# EAGLE design PixelShirtConsole (EAGLE 7.2.1)
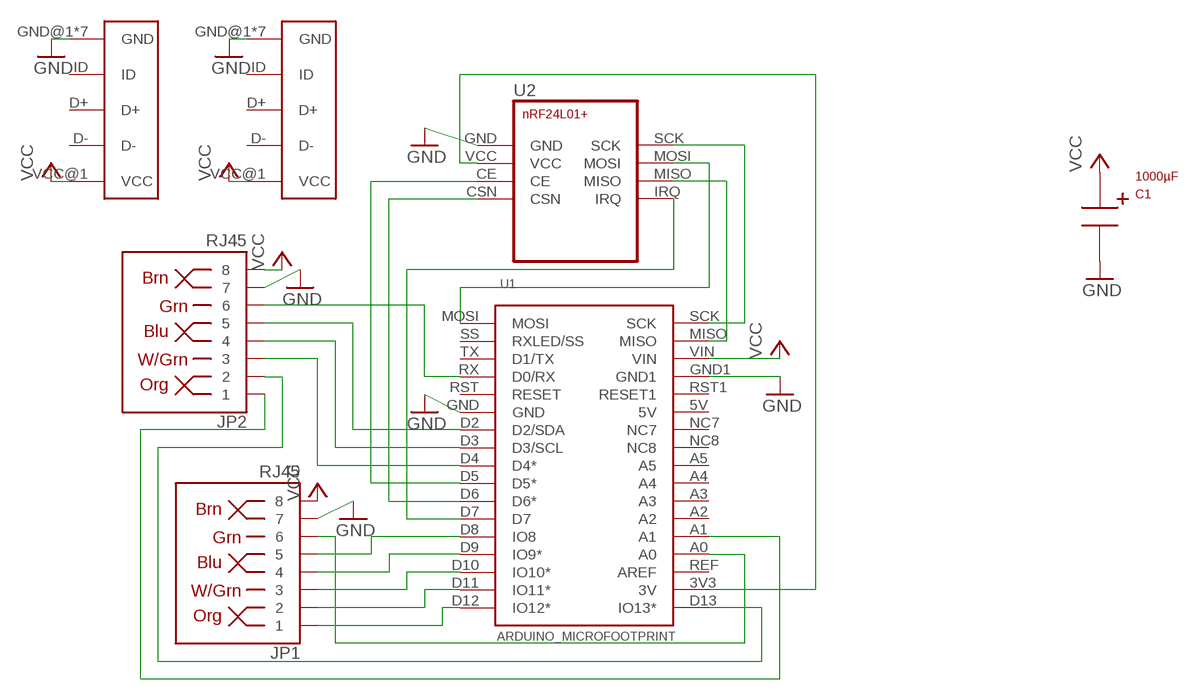
[diagram p0: schematic, sheet 1]

## Parts
C1  1000µF  CAP-CUSTOM  [CAP-CUSTOM]
JP1  RJ45  RJ45-8PTH  [RJ45-8]
JP2  RJ45  RJ45-8PTH  [RJ45-8]
JP3  USB-MICRO-B  [USB-MICRO-B]
JP4  USB-MICRO-B  [USB-MICRO-B]
U1  ARDUINO_MICROFOOTPRINT  [ARDUINO-MICRO]
U2  NRF24L01+  [NRF24L01+]

## Nets
GND: C1.GND JP1.7 JP2.7 JP3.GND@1(GND) JP3.GND@2(GND) JP3.GND@3(GND) JP3.GND@5(GND) JP3.GND@6(GND) JP3.GND@7(GND) JP3.GNF@4(GND) JP4.GND@1(GND) JP4.GND@2(GND) JP4.GND@3(GND) JP4.GND@5(GND) JP4.GND@6(GND) JP4.GND@7(GND) JP4.GNF@4(GND) U1.GND U1.GND1 U2.GND
N$1: U1.MISO U2.MISO
N$2: U1.SCK U2.SCK
N$3: U1.D6(D6*) U2.CSN
N$4: U1.D5(D5*) U2.CE
N$5: U1.MOSI U2.MOSI
N$6: U1.D7 U2.IRQ
N$7: JP1.2 U1.D11(IO11*)
N$8: JP1.3 U1.D10(IO10*)
N$9: JP1.4 U1.D9(IO9*)
N$10: JP1.1 U1.D12(IO12*)
N$11: JP1.6 U1.A0
N$12: JP1.5 U1.D8(IO8)
N$13: JP2.5 U1.D2(D2/SDA)
N$14: JP2.4 U1.D3(D3/SCL)
N$15: JP2.3 U1.D4(D4*)
N$16: JP2.6 U1.RX(D0/RX)
N$17: JP2.1 U1.A1
N$18: JP2.2 U1.D13(IO13*)
N$19: U1.3V3(3V) U2.VCC
VCC: C1.VCC JP1.8 JP2.8 JP3.VCC@1(VCC) JP4.VCC@1(VCC) U1.VIN
Unconnected: JP3.D+ JP3.D- JP3.ID JP4.D+ JP4.D- JP4.ID U1.5V U1.A2 U1.A3 U1.A4 U1.A5 U1.NC7 U1.NC8 U1.REF(AREF) U1.RST1(RESET1) U1.RST(RESET) U1.SS(RXLED/SS) U1.TX(D1/TX)

## Library data of the parts
C1 = usb:CAP-CUSTOM
JP1 JP2 = SparkFun-Connectors:RJ45-8: RJ45 Jack Simple RJ45, 8-pin connection - connector for common Cat5, Cat5e, and Cat6 Ethernet cables. Footprint not yet proven in production. Connector sku is PRT-00643; Breakout PCB sku is BOB-00716.; PROD_ID: CONN-08506
JP3 JP4 = usb:USB-MICRO-B
U1 = arduino-micro:ARDUINO_MICRO
U2 = nrf24L01%2B:NRF24L01+: nRF24L01+ Transceiver Module

## Board
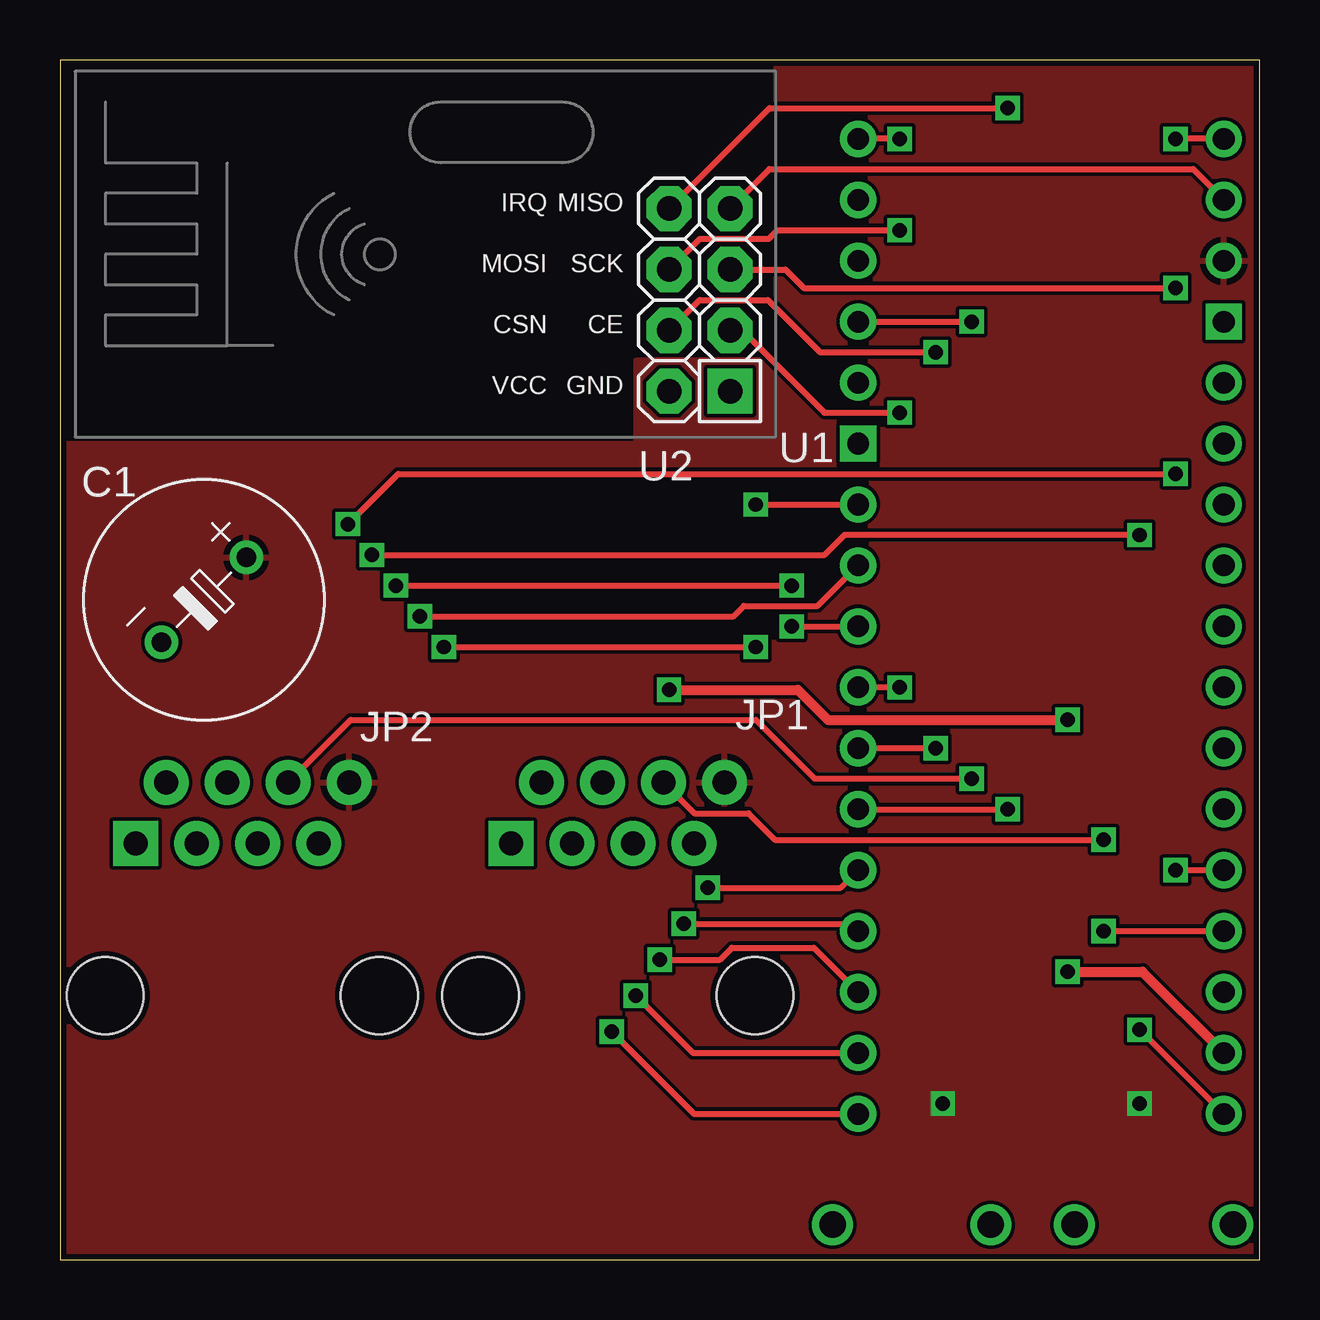
[diagram p1: board, top side]
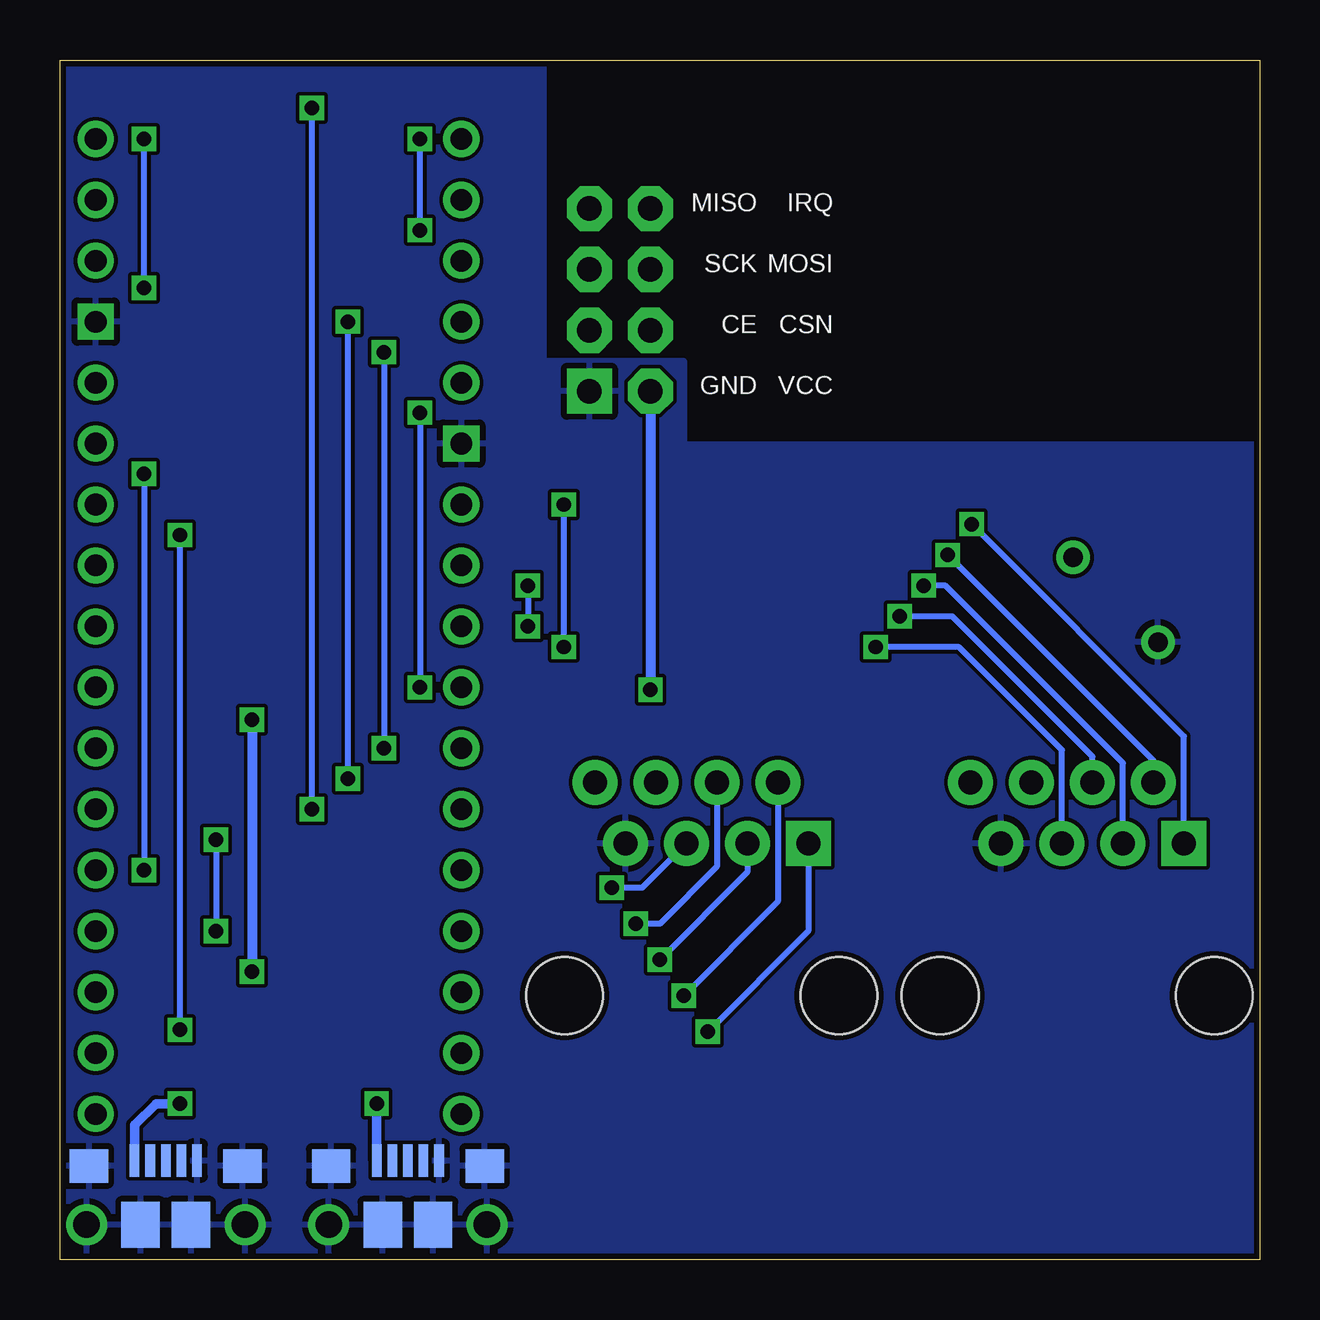
[diagram p2: board, bottom side, seen from below]

Size 50 x 50 mm. Coordinates in mm from the lower left corner, seen from the top.
Outline: 0,0 50,0 50,50 0,50 0,0
Copper layers (1*16): Top 0.035mm / dielectric 1.5mm / Bottom 0.035mm
Design rules "DFRobot_Eagle_Rule_v0.4": minimum track width 6mil, minimum drill 12mil, track to track 6mil, track to pad 6mil, pad to pad 6mil, via to via 6mil, smd to smd 0mil, copper to edge 10mil, drill to drill 10mil, minimum pad ring 12mil, minimum via ring 8mil, stop-mask expansion 2mil, vias tented up to drill 25mil, thermal gap 10mil

### Footprints (pad centres in the part's own frame; a part is rotated, then mirrored left to right if it is on the bottom)
CAP-CUSTOM = drill 0.8: GND -2.5,0; VCC 2.5,0
RJ45-8 = drill 1 pad 1.88 square: 1 -4.445,6.35 | drill 1 pad 1.88: 2 -3.175,8.89; 3 -1.905,6.35; 4 -0.635,8.89; 5 0.635,6.35; 6 1.905,8.89; 7 3.175,6.35; 8 4.445,8.89 | hole 3.2: -5.715,0; 5.715,0
USB-MICRO-B = smd 0.4 x 1.35: D+ 0,2.675; D- -0.65,2.675; GND@1 1.3,2.675; ID 0.65,2.675; VCC@1 -1.3,2.675 | smd 1.6 x 1.4: GND@2 -3.2,2.45; GND@3 3.2,2.45 | smd 1.6 x 1.9: GND@5 1.05,0; GNF@4 -1.05,0 | drill 1.1 pad 1.5: GND@6 -3.3,0; GND@7 3.3,0
ARDUINO-MICRO = drill 0.9: 3V3 16.51,3.81; 5V 16.51,29.21; A0 16.51,8.89; A1 16.51,11.43; A2 16.51,13.97; A3 16.51,16.51; A4 16.51,19.05; A5 16.51,21.59; D2 1.27,26.67; D3 1.27,24.13; D4 1.27,21.59; D5 1.27,19.05; D6 1.27,16.51; D7 1.27,13.97; D8 1.27,11.43; D9 1.27,8.89; D10 1.27,6.35; D11 1.27,3.81; D12 1.27,1.27; D13 16.51,1.27; MISO 16.51,39.37; MOSI 1.27,41.91; NC7 16.51,26.67; NC8 16.51,24.13; REF 16.51,6.35; RST 1.27,31.75; RST1 16.51,31.75; RX 1.27,34.29; SCK 16.51,41.91; SS 1.27,39.37; TX 1.27,36.83; VIN 16.51,36.83 | drill 0.9 square: GND 1.27,29.21; GND1 16.51,34.29
NRF24L01+ = drill 1.016 pad 1.88 octagon: CE -11.43,1.27; CSN -8.89,1.27; IRQ -8.89,-3.81; MISO -11.43,-3.81; MOSI -8.89,-1.27; SCK -11.43,-1.27; VCC -8.89,3.81 | drill 1.016 pad 1.88 square: GND -11.43,3.81

### Placement (x,y rotation side)
C1  6,27.5 45 top
JP1  23.25,11 0 top
JP2  7.6,11 0 top
JP3  45.59,1.45 0 bottom
JP4  35.5,1.45 0 bottom
U1  32,4.8 0 top
U2  16.5,40 180 top

### Tracks (layer width: path | path; a pad name or v marks a point on that pad's centre or on a via)
GND
  pour Bottom: 0,0 50,0 50,50 29.84,50 29.84,37.46 24,37.46 24,34 0,34
N$1
  Top 0.254: U1.MISO 47.23,45.45 29.57,45.45 U2.MISO
N$2  (via drill 0.6)
  Top 0.254: v46.5,40.5 31,40.5 30.23,41.27 U2.SCK | U1.SCK v46.5,46.71
  Bottom 0.254: v46.5,40.5 v46.5,46.71
N$3  (via drill 0.6)
  Top 0.254: v36.5,21.31 U1.D6 | U2.CSN 26.66,40 29.5,40 31.68,37.82 v36.5,37.82
  Bottom 0.254: v36.5,37.82 v36.5,21.31
N$4  (via drill 0.6)
  Top 0.254: v35,23.85 U1.D5 | v35,35.3 31.86,35.3 28.43,38.73 U2.CE
  Bottom 0.254: v35,35.3 v35,23.85
N$5  (via drill 0.6)
  Top 0.254: U2.MOSI 26.67,42.55 29.55,42.55 29.9,42.9 v35,42.9 | v35,46.71 U1.MOSI
  Bottom 0.254: v35,42.9 v35,46.71
N$6  (via drill 0.6)
  Top 0.254: U1.D7 v39.5,18.77 | U2.IRQ 29.58,48 v39.5,48
  Bottom 0.254: v39.5,18.77 v39.5,48
N$7  (via drill 0.6)
  Top 0.254: v24,11 26.39,8.61 U1.D11
  Bottom 0.254: JP1.2 20.07,14.93 v24,11
N$8  (via drill 0.6)
  Top 0.254: v25,12.5 27.5,12.5 28,13 31.42,13 U1.D10
  Bottom 0.254: JP1.3 21.34,16.16 v25,12.5
N$9  (via drill 0.6)
  Top 0.254: v26,14 32.96,14 U1.D9
  Bottom 0.254: JP1.4 22.61,16.39 25,14 v26,14
N$10  (via drill 0.6)
  Top 0.254: v23,9.5 26.43,6.07 U1.D12
  Bottom 0.254: JP1.1 18.8,13.7 v23,9.5
N$11  (via drill 0.6)
  Top 0.254: v43.5,13.69 U1.A0 | v43.5,17.5 29.8,17.5 28.7,18.6 26.45,18.6 JP1.6
  Bottom 0.254: v43.5,17.5 v43.5,13.69
N$12  (via drill 0.6)
  Top 0.254: v27,15.5 32.54,15.5 U1.D8
  Bottom 0.254: JP1.5 25.73,15.5 v27,15.5
N$13  (via drill 0.6)
  Top 0.254: v29,31.47 U1.D2 | v16,25.53 v29,25.53
  Bottom 0.254: v29,25.53 v29,31.47 | JP2.5 8.23,21.23 12.53,25.53 v16,25.53
N$14  (via drill 0.6)
  Top 0.254: U1.D3 31.58,27.24 28.5,27.24 28.07,26.81 v15,26.81
  Bottom 0.254: JP2.4 6.96,20.96 12.81,26.81 v15,26.81
N$15  (via drill 0.6)
  Top 0.254: v30.5,26.39 U1.D4 | v14,28.09 v30.5,28.09
  Bottom 0.254: v30.5,28.09 v30.5,26.39 | JP2.3 5.7,20.7 13.09,28.09 v14,28.09
N$16  (via drill 0.6)
  Top 0.254: U1.RX v38,39.09 | v38,20.04 31.46,20.04 29,22.5 12.12,22.5 JP2.6
  Bottom 0.254: v38,20.04 v38,39.09
N$17  (via drill 0.6)
  Top 0.254: v46.5,16.23 U1.A1 | v12,30.65 14.1,32.75 v46.5,32.75
  Bottom 0.254: v46.5,32.75 v46.5,16.23 | JP2.1 3.15,21.8 v12,30.65
N$18  (via drill 0.6)
  Top 0.254: U1.D13 v45,9.58 | v13,29.37 31.87,29.37 32.7,30.2 v45,30.2
  Bottom 0.254: v45,9.58 v45,30.2 | JP2.2 4.42,20.8 v13,29.37
N$19  (via drill 0.6)
  Top 0.406: v25.39,23.75 30.75,23.75 32,22.5 v42,22.5 | v42,12 45.12,12 U1.3V3
  Bottom 0.406: U2.VCC v25.39,23.75 | v42,22.5 v42,12
VCC  (via drill 0.6)
  Bottom 0.4: JP4.VCC@1 v36.8,6.5 | v45,6.5 46,6.5 46.89,5.61 JP3.VCC@1
  pour Top: 0,0 50,0 50,50 29.84,50 29.84,37.46 24,37.46 24,34 0,34

### Text on the board
tDocu: Adam Feinstein (C) 2015
bDocu: Os - A1 / O - 13 / Gs - 4 / U - 3 / Us - 2 / G - 0 / Bs - GND / B - VCC | Os - 12 / O - 11 / Gs - 10 / U - 9 / Us - 8 / G - A0 / Bs - GND / B - VCC